# EAGLE board ARE_adaptadores (EAGLE 6.1), part 1 of 2
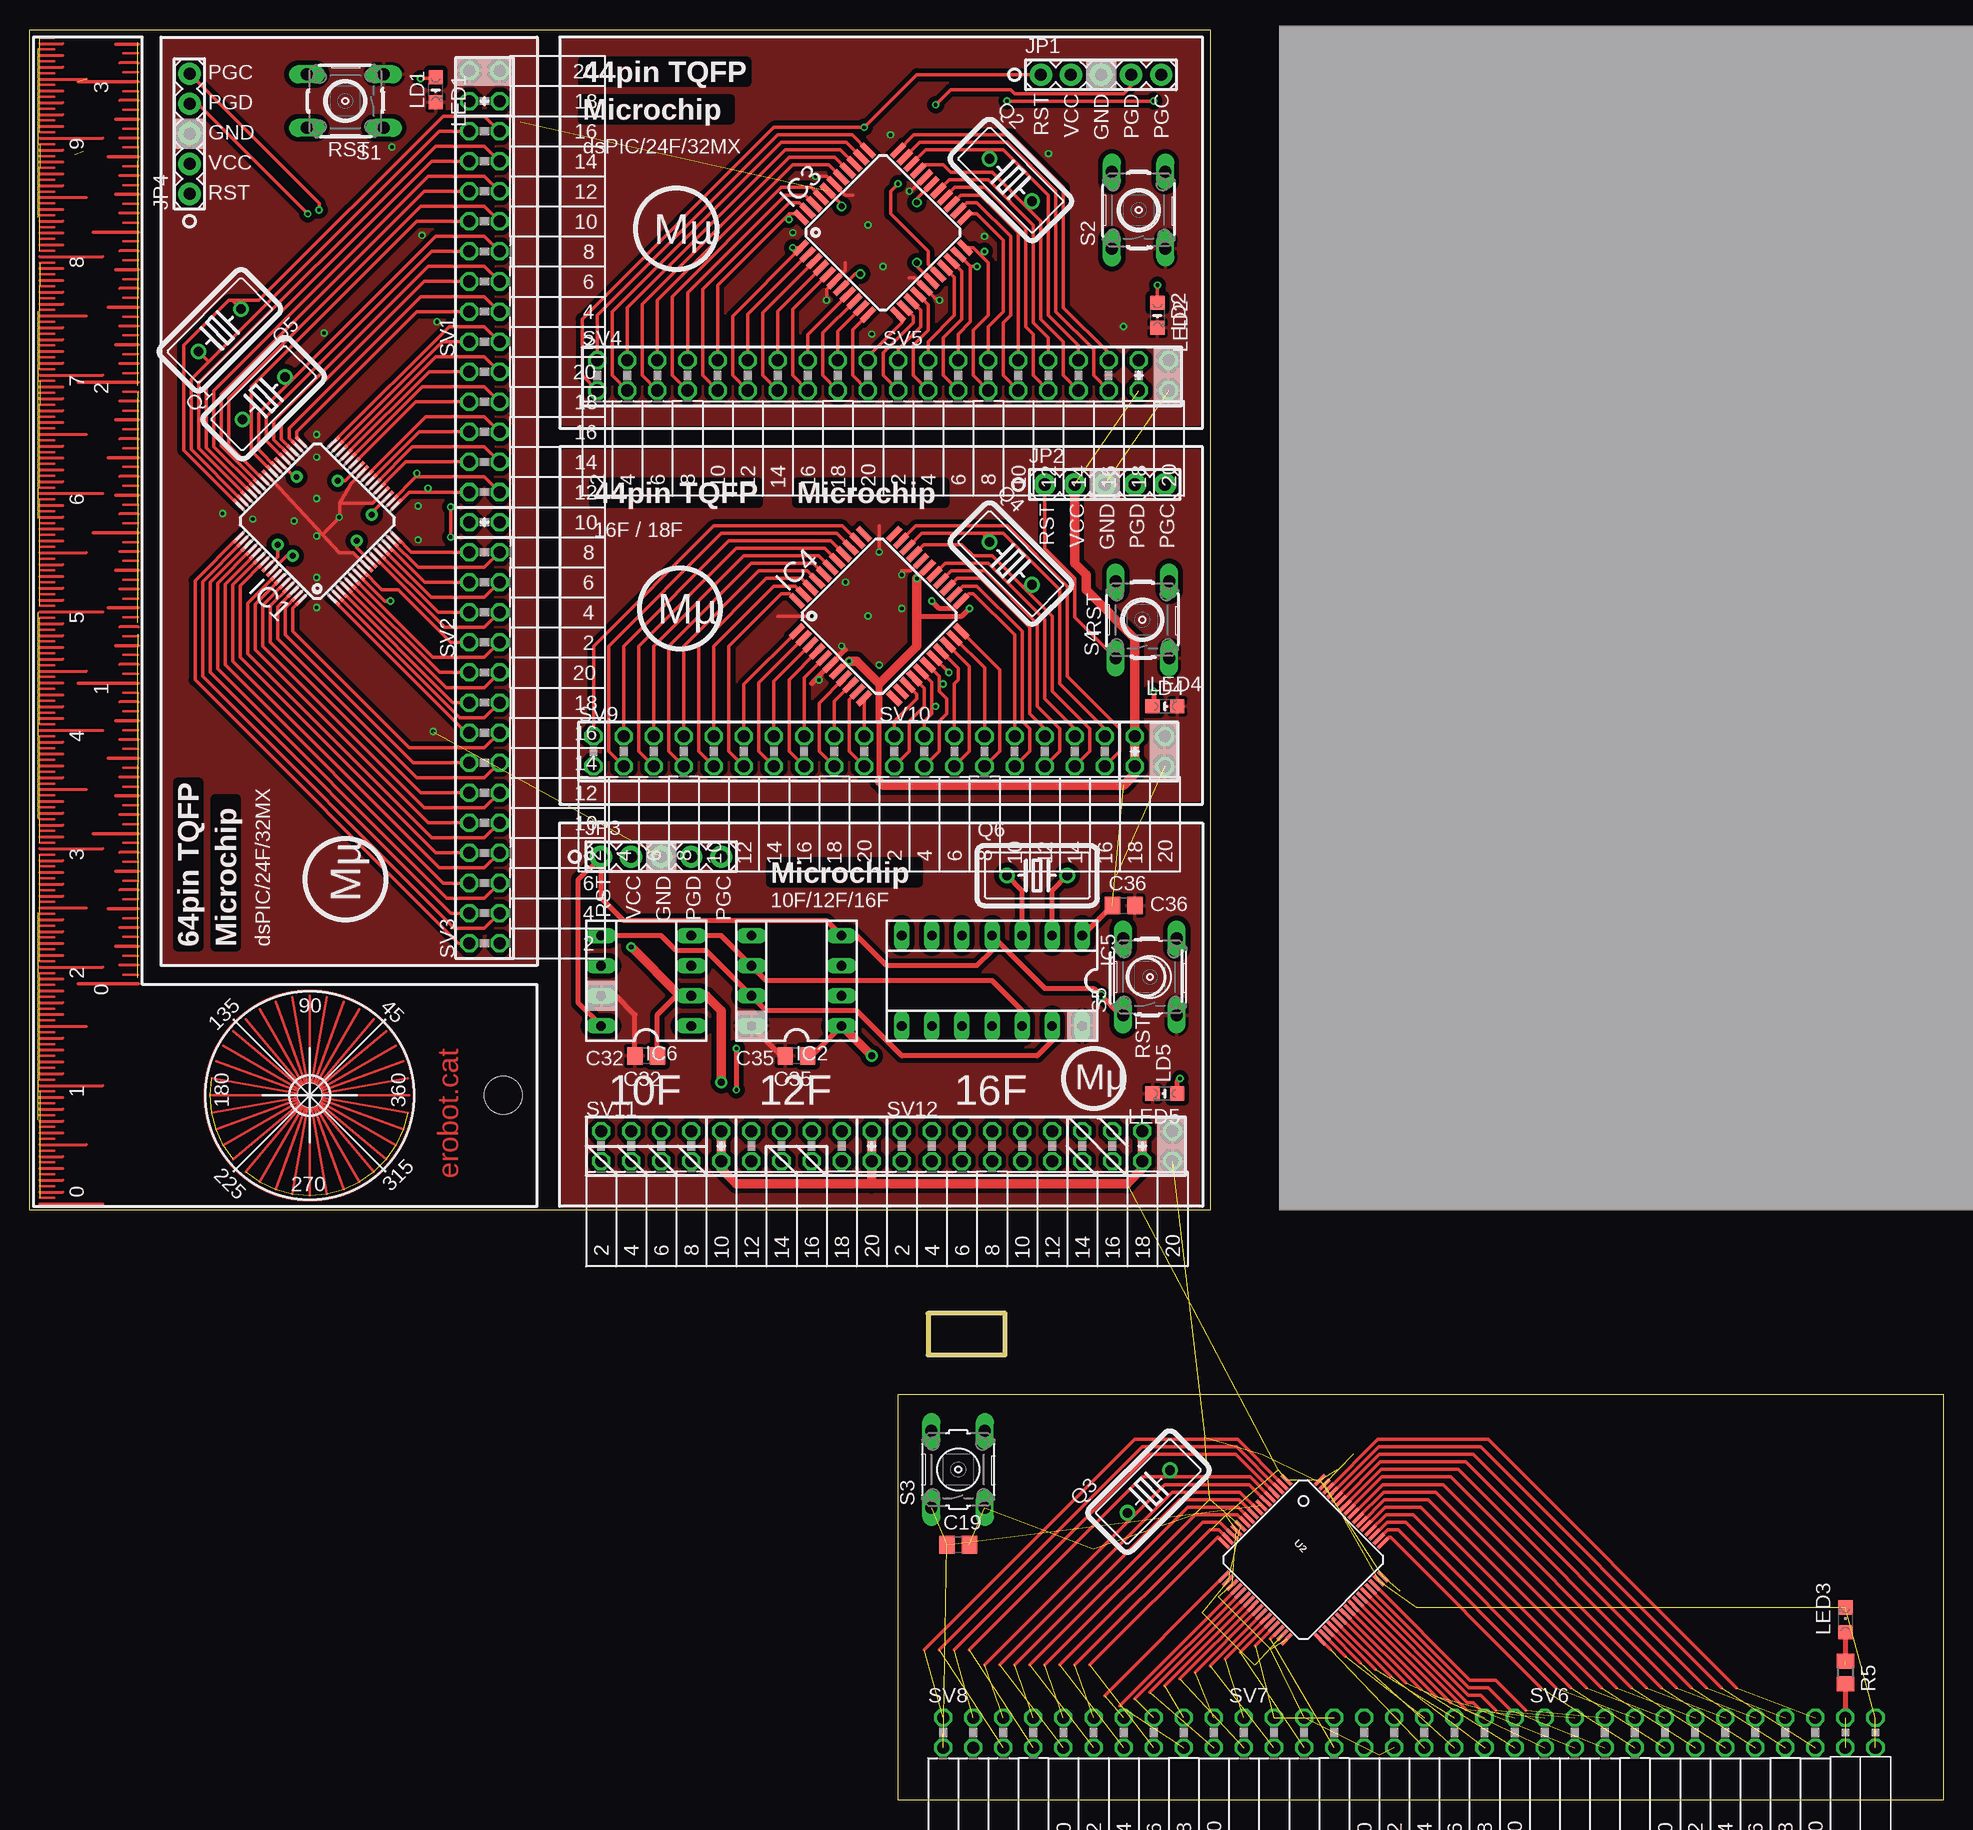
[diagram p5: board, top side]
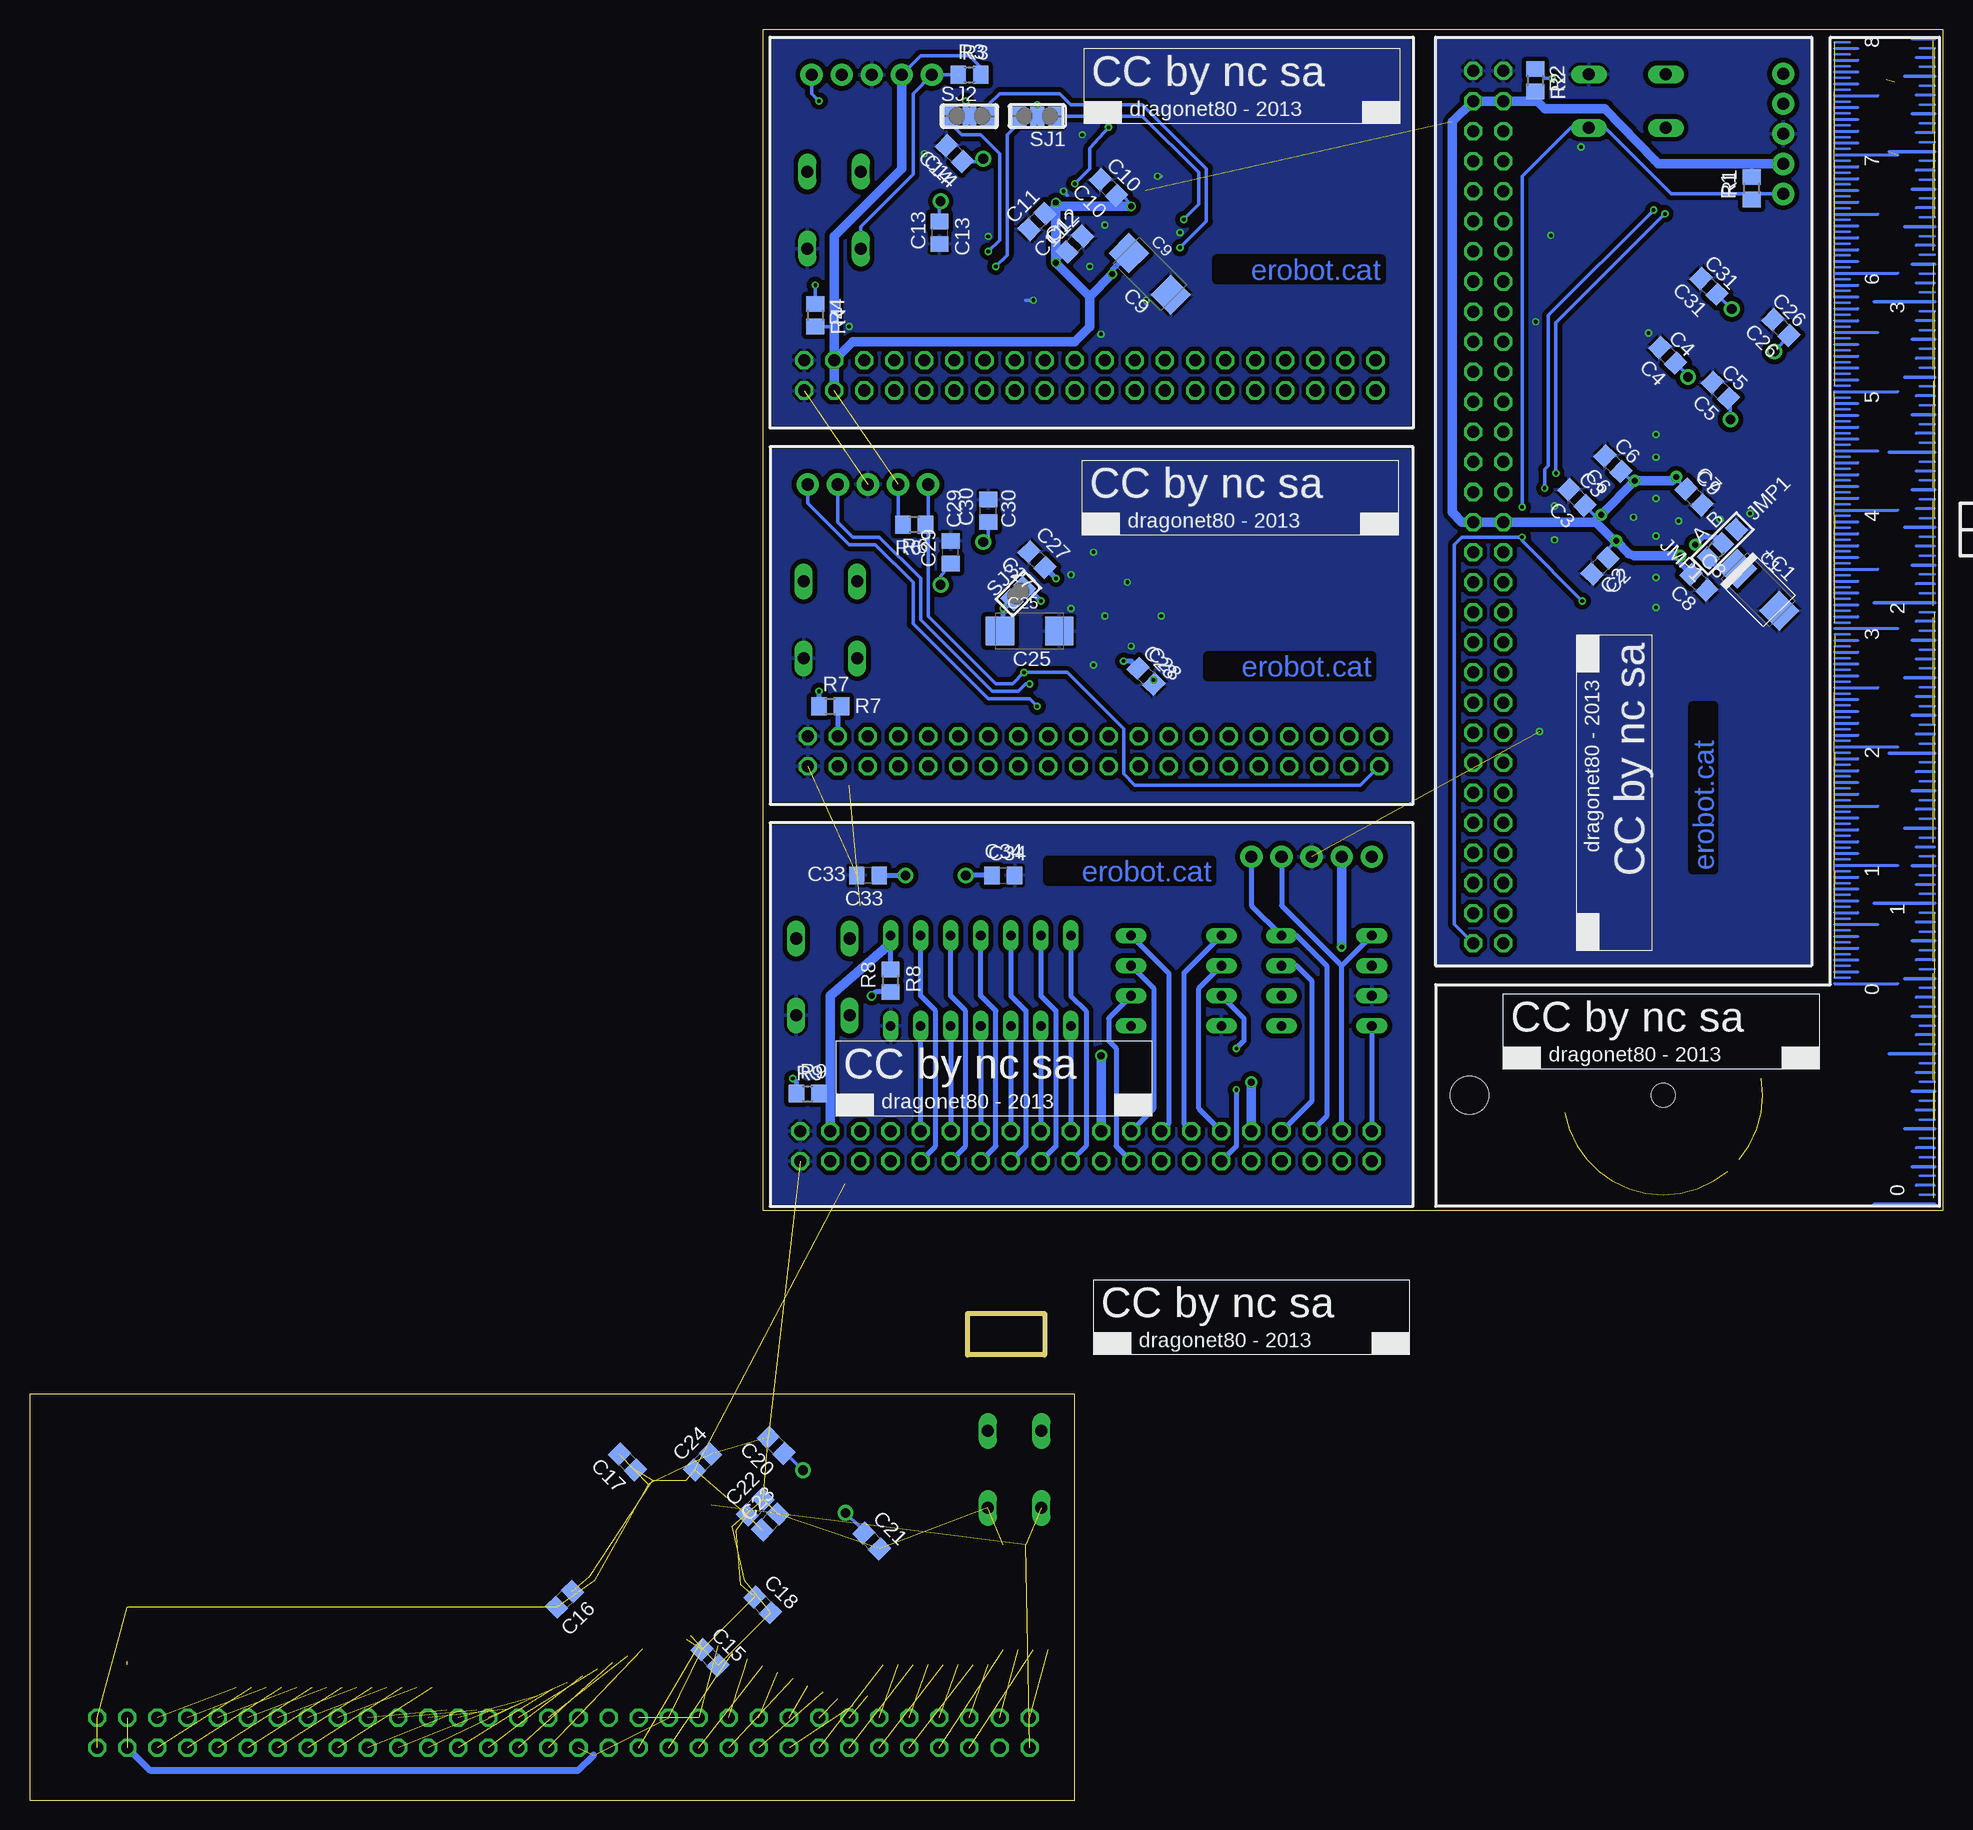
[diagram p6: board, bottom side, seen from below]

Size 161.61 x 149.54 mm. Coordinates in mm from the lower left corner, seen from the top.
Outline: 73.34,0 73.34,34.29 161.61,34.29 161.61,0 73.34,0
Outline: 75.88,37.62 82.38,37.62 82.38,41.12 75.88,41.12 75.88,37.62
Outline: 99.69,149.54 99.69,49.85 0,49.85 0,149.54 99.69,149.54
Copper layers (1*16): Top 0.035mm / dielectric 1.5mm / Bottom 0.035mm
Design rules: minimum track width 6mil, minimum drill 12mil, track to track 6mil, track to pad 6mil, pad to pad 6mil, via to via 6mil, smd to smd 0mil, copper to edge 10mil, drill to drill 10mil, minimum pad ring 10mil, minimum via ring 6mil, stop-mask expansion 2mil, vias tented up to drill 100mil, thermal gap 10mil
Holes 3.2 mm at 40.01,59.53
Holes 2 mm at 23.65,59.53

## Footprints (pad centres in the part's own frame; a part is rotated, then mirrored left to right if it is on the bottom)
SMC_C = smd 2.4 x 2.4: + -2.5,0; - 2.5,0
C0805 = smd 1.3 x 1.5: 1 -0.95,0; 2 0.95,0
TQFP64-10X10 = smd 1.2 x 0.3: 1 -5.7,3.75; 2 -5.7,3.25; 3 -5.7,2.75; 4 -5.7,2.25; 5 -5.7,1.75; 6 -5.7,1.25; 7 -5.7,0.75; 8 -5.7,0.25; 9 -5.7,-0.25; 10 -5.7,-0.75; 11 -5.7,-1.25; 12 -5.7,-1.75; 13 -5.7,-2.25; 14 -5.7,-2.75; 15 -5.7,-3.25; 16 -5.7,-3.75; 33 5.7,-3.75; 34 5.7,-3.25; 35 5.7,-2.75; 36 5.7,-2.25; 37 5.7,-1.75; 38 5.7,-1.25; 39 5.7,-0.75; 40 5.7,-0.25; 41 5.7,0.25; 42 5.7,0.75; 43 5.7,1.25; 44 5.7,1.75; 45 5.7,2.25; 46 5.7,2.75; 47 5.7,3.25; 48 5.7,3.75 | smd 0.3 x 1.2: 17 -3.75,-5.7; 18 -3.25,-5.7; 19 -2.75,-5.7; 20 -2.25,-5.7; 21 -1.75,-5.7; 22 -1.25,-5.7; 23 -0.75,-5.7; 24 -0.25,-5.7; 25 0.25,-5.7; 26 0.75,-5.7; 27 1.25,-5.7; 28 1.75,-5.7; 29 2.25,-5.7; 30 2.75,-5.7; 31 3.25,-5.7; 32 3.75,-5.7; 49 3.75,5.7; 50 3.25,5.7; 51 2.75,5.7; 52 2.25,5.7; 53 1.75,5.7; 54 1.25,5.7; 55 0.75,5.7; 56 0.25,5.7; 57 -0.25,5.7; 58 -0.75,5.7; 59 -1.25,5.7; 60 -1.75,5.7; 61 -2.25,5.7; 62 -2.75,5.7; 63 -3.25,5.7; 64 -3.75,5.7
SOCKET-08 = drill 0.813 long: 1 -3.81,-3.81; 2 -1.27,-3.81; 3 1.27,-3.81; 4 3.81,-3.81; 5 3.81,3.81; 6 1.27,3.81; 7 -1.27,3.81; 8 -3.81,3.81
TQFP44 = smd 1.5 x 0.5: 1 -5.8,4; 2 -5.8,3.2; 3 -5.8,2.4; 4 -5.8,1.6; 5 -5.8,0.8; 6 -5.8,0; 7 -5.8,-0.8; 8 -5.8,-1.6; 9 -5.8,-2.4; 10 -5.8,-3.2; 11 -5.8,-4; 23 5.8,-4; 24 5.8,-3.2; 25 5.8,-2.4; 26 5.8,-1.6; 27 5.8,-0.8; 28 5.8,0; 29 5.8,0.8; 30 5.8,1.6; 31 5.8,2.4; 32 5.8,3.2; 33 5.8,4 | smd 0.5 x 1.5: 12 -4,-5.8; 13 -3.2,-5.8; 14 -2.4,-5.8; 15 -1.6,-5.8; 16 -0.8,-5.8; 17 0,-5.8; 18 0.8,-5.8; 19 1.6,-5.8; 20 2.4,-5.8; 21 3.2,-5.8; 22 4,-5.8; 34 4,5.8; 35 3.2,5.8; 36 2.4,5.8; 37 1.6,5.8; 38 0.8,5.8; 39 0,5.8; 40 -0.8,5.8; 41 -1.6,5.8; 42 -2.4,5.8; 43 -3.2,5.8; 44 -4,5.8
SOCKET-14 = drill 0.813 long: 1 -7.62,-3.81; 2 -5.08,-3.81; 3 -2.54,-3.81; 4 0,-3.81; 5 2.54,-3.81; 6 5.08,-3.81; 7 7.62,-3.81; 8 7.62,3.81; 9 5.08,3.81; 10 2.54,3.81; 11 0,3.81; 12 -2.54,3.81; 13 -5.08,3.81; 14 -7.62,3.81
A0R-JMP = smd 1.5 x 1.3: 1 0,1.7; 2 0,0; 3 0,-1.7
1X05 = drill 1.016 pad 1.88: 1 0,0; 2 2.54,0; 3 5.08,0; 4 7.62,0; 5 10.16,0
CHIPLED_0805 = smd 1.2 x 1.2: A 0,-1.05; C 0,1.05
HC18U-V = drill 0.813: 1 -2.54,0; 2 2.54,0
R0805 = smd 1.3 x 1.5: 1 -0.95,0; 2 0.95,0
B3F-10XX = drill 1.016 long: 1 -3.251,2.261; 2 3.251,2.261; 3 -3.251,-2.261; 4 3.251,-2.261
SJ_2 = smd 1.168 x 1.6: 1 -1.524,0; 2 0,0; 3 1.524,0
SJ = smd 1.168 x 1.6: 1 -0.762,0; 2 0.762,0
FE10-2W = drill 1.016 octagon: 1 -11.43,1.27; 2 -11.43,-1.27; 3 -8.89,1.27; 4 -8.89,-1.27; 5 -6.35,1.27; 6 -6.35,-1.27; 7 -3.81,1.27; 8 -3.81,-1.27; 9 -1.27,1.27; 10 -1.27,-1.27; 11 1.27,1.27; 12 1.27,-1.27; 13 3.81,1.27; 14 3.81,-1.27; 15 6.35,1.27; 16 6.35,-1.27; 17 8.89,1.27; 18 8.89,-1.27; 19 11.43,1.27; 20 11.43,-1.27
LQFP64 = smd 1.2 x 0.3: 1 -5.75,3.75; 2 -5.75,3.25; 3 -5.75,2.75; 4 -5.75,2.25; 5 -5.75,1.75; 6 -5.75,1.25; 7 -5.75,0.75; 8 -5.75,0.25; 9 -5.75,-0.25; 10 -5.75,-0.75; 11 -5.75,-1.25; 12 -5.75,-1.75; 13 -5.75,-2.25; 14 -5.75,-2.75; 15 -5.75,-3.25; 16 -5.75,-3.75; 33 5.75,-3.75; 34 5.75,-3.25; 35 5.75,-2.75; 36 5.75,-2.25; 37 5.75,-1.75; 38 5.75,-1.25; 39 5.75,-0.75; 40 5.75,-0.25; 41 5.75,0.25; 42 5.75,0.75; 43 5.75,1.25; 44 5.75,1.75; 45 5.75,2.25; 46 5.75,2.75; 47 5.75,3.25; 48 5.75,3.75 | smd 0.3 x 1.2: 17 -3.75,-5.75; 18 -3.25,-5.75; 19 -2.75,-5.75; 20 -2.25,-5.75; 21 -1.75,-5.75; 22 -1.25,-5.75; 23 -0.75,-5.75; 24 -0.25,-5.75; 25 0.25,-5.75; 26 0.75,-5.75; 27 1.25,-5.75; 28 1.75,-5.75; 29 2.25,-5.75; 30 2.75,-5.75; 31 3.25,-5.75; 32 3.75,-5.75; 49 3.75,5.75; 50 3.25,5.75; 51 2.75,5.75; 52 2.25,5.75; 53 1.75,5.75; 54 1.25,5.75; 55 0.75,5.75; 56 0.25,5.75; 57 -0.25,5.75; 58 -0.75,5.75; 59 -1.25,5.75; 60 -1.75,5.75; 61 -2.25,5.75; 62 -2.75,5.75; 63 -3.25,5.75; 64 -3.75,5.75
FE02-2W = drill 1.016 octagon: 1 -1.27,1.27; 2 -1.27,-1.27; 3 1.27,1.27; 4 1.27,-1.27

## Placement (x,y rotation side)
C1  10uF  [SMC_C]  15.61,102.23 315 bottom
C2  100n  [C0805]  28.97,104.24 225 bottom
C3  100n  [C0805]  30.94,110.02 135 bottom
C4  18p  [C0805]  23.26,122.04 135 bottom
C5  18p  [C0805]  18.8,119.08 135 bottom
C6  100n  [C0805]  27.89,112.88 135 bottom
C7  100n  [C0805]  21.03,110.08 315 bottom
C8  100n  [C0805]  20.64,102.87 315 bottom
C9  10uF  [SMC_C]  66.99,128.91 315 bottom
C10  100n  [C0805]  70.49,136.21 135 bottom
C11  100n  [C0805]  76.52,133.35 225 bottom
C12  100n  [C0805]  73.34,131.44 45 bottom
C13  18p  [C0805]  84.77,132.4 270 bottom
C14  18p  [C0805]  83.5,139.06 135 bottom
C15  100n  [C0805]  104.14,12.06 315 bottom
C16  100n  [C0805]  116.44,16.98 225 bottom
C17  100n  [C0805]  111.12,28.58 135 bottom
C18  100n  [C0805]  99.69,16.51 315 bottom
C19  100n  [C0805]  78.42,21.59 0 top
C20  18p  [C0805]  98.56,29.98 135 bottom
C21  18p  [C0805]  90.49,21.91 315 bottom
C22  100n  [C0805]  100.33,24.77 45 bottom
C23  1u  [C0805]  99.06,23.5 45 bottom
C24  100n  [C0805]  104.78,28.58 45 bottom
C25  10uF  [SMC_C]  77.15,98.74 0 bottom
C26  18p  [C0805]  13.7,124.37 135 bottom
C27  100n  [C0805]  76.52,104.78 135 bottom
C28  100n  [C0805]  67.31,94.93 315 bottom
C29  18p  [C0805]  83.82,105.41 90 bottom
C30  18p  [C0805]  80.64,108.9 90 bottom
C31  18p  [C0805]  19.78,127.87 135 bottom
C32  100n  [C0805]  52.07,62.87 180 top
C33  18p  [C0805]  90.81,78.11 180 bottom
C34  18p  [C0805]  79.38,78.11 0 bottom
C35  100n  [C0805]  64.77,62.87 180 top
C36  100n  [C0805]  92.39,75.56 0 top
IC1  PIC32MX  [TQFP64-10X10]  24.31,108.04 135 top
IC2  12F  [SOCKET-08]  64.77,69.22 90 top
IC3  PIC24FJ32GA004  [TQFP44]  72.07,132.4 45 top
IC4  PIC16F1517/19PT  [TQFP44]  71.75,100 45 top
IC5  16F  [SOCKET-14]  81.28,69.22 180 top
IC6  10F  [SOCKET-08]  52.07,69.22 90 top
JMP1  0R-JUMPA  [A0R-JMP]  18.64,106.14 135 bottom
JP1  [1X05]  85.41,145.73 0 top
JP2  [1X05]  85.72,111.12 0 top
JP3  [1X05]  48.26,79.69 0 top
JP4  [1X05]  13.51,135.66 90 top
LED1  [CHIPLED_0805]  34.29,144.46 180 top
LED2  [CHIPLED_0805]  95.25,125.41 180 top
LED3  [CHIPLED_0805]  153.35,15.24 0 top
LED4  [CHIPLED_0805]  95.88,92.39 270 top
LED5  [CHIPLED_0805]  95.88,59.69 90 top
Q1  [HC18U-V]  19.77,118.42 45 top
Q2  [HC18U-V]  82.87,136.84 315 top
Q3  [HC18U-V]  94.5,26.08 45 top
Q4  [HC18U-V]  82.87,104.46 315 top
Q5  [HC18U-V]  16.06,124.14 225 top
Q6  [HC18U-V]  85.09,78.11 0 top
R1  4K7  [R0805]  16.17,136.14 90 bottom
R2  1K  [R0805]  34.45,145.26 270 bottom
R3  4K7  [R0805]  82.23,145.73 0 bottom
R4  1K  [R0805]  95.25,125.41 270 bottom
R5  1K  [R0805]  153.35,10.8 270 top
R6  4K7  [R0805]  86.9,107.73 180 bottom
R7  1K  [R0805]  93.98,92.39 0 bottom
R8  4K7  [R0805]  88.9,69.22 90 bottom
R9  1K  [R0805]  95.88,59.69 0 bottom
S1  [B3F-10XX]  26.67,143.51 180 top
S2  [B3F-10XX]  93.66,134.3 90 top
S3  [B3F-10XX]  78.42,27.94 90 top
S4  [B3F-10XX]  93.98,99.7 90 top
S5  [B3F-10XX]  94.61,69.53 90 top
SJ1  [SJ_2]  76.52,142.24 180 bottom
SJ2  [SJ_2]  82.23,142.24 0 bottom
SJ3  [SJ]  78.1,101.92 45 bottom
SV1  [FE10-2W]  38.42,134.62 90 top
SV2  [FE10-2W]  38.42,109.22 90 top
SV3  [FE10-2W]  38.42,83.82 90 top
SV4  [FE10-2W]  59.37,120.33 0 top
SV5  [FE10-2W]  84.77,120.33 0 top
SV6  [FE10-2W]  139.38,5.72 0 top
SV7  [FE10-2W]  113.98,5.72 0 top
SV8  [FE10-2W]  88.58,5.72 0 top
SV9  [FE10-2W]  59.05,88.58 0 top
SV10  [FE10-2W]  84.45,88.58 0 top
SV11  [FE10-2W]  59.69,55.25 0 top
SV12  [FE10-2W]  85.09,55.25 0 top
U2  STM32-M-64-LQFP  [LQFP64]  107.58,20.32 315 top
U$3  FE02-2W  [FE02-2W]  154.62,5.72 0 top